# Altium schematic sheet Sheet1.SchDoc
size A3; SheetNumber: 1; SheetTotal: 1
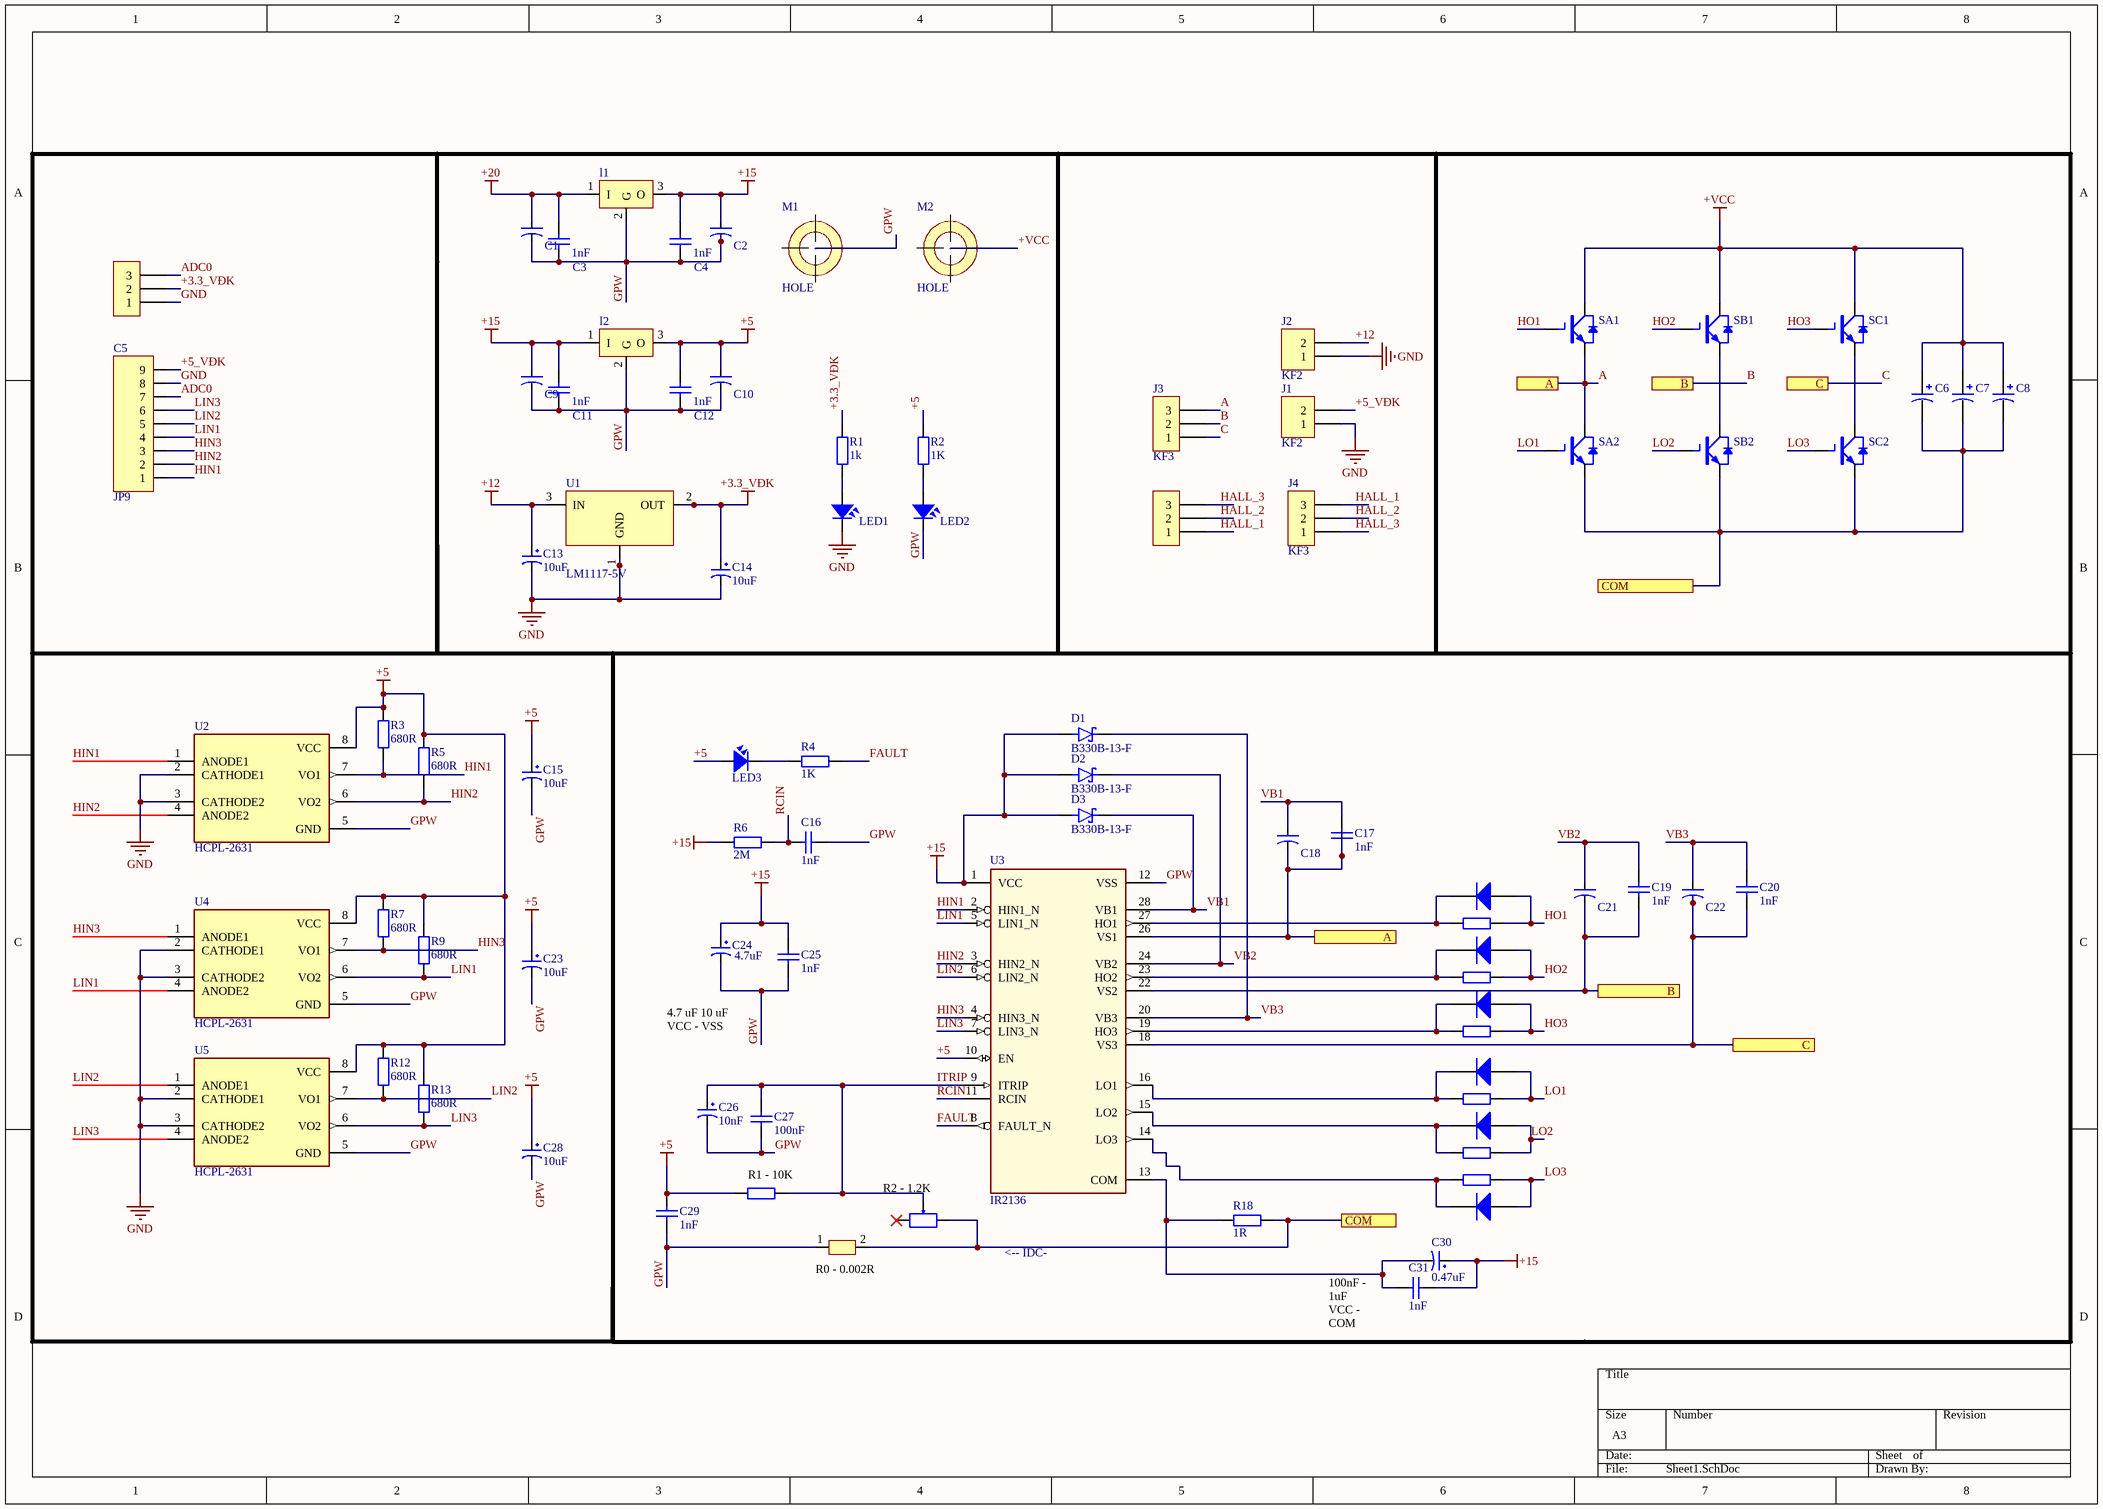
[diagram p0: Sheet1.SchDoc]

## Parts
*1  Component_1  [PCBComponent_1]  (value not drawn)
C1  CN-ALU-DIP  [CA-ALU-5]  (value not drawn)
C2  CN-ALU-DIP  [CA-ALU-5]  (value not drawn)
C3  1nF  [tu 1206]
C4  1nF  [tu 1206]
C5  JP9  [JP9-C1T]
C6  150uF - 450V  [CAP_ALUM_D160_S75_H250]  (value not drawn)
C7  150uF - 450V  [CAP_ALUM_D160_S75_H250]  (value not drawn)
C8  150uF - 450V  [CAP_ALUM_D160_S75_H250]  (value not drawn)
C9  CN-ALU-DIP  [CA-ALU-5]  (value not drawn)
C10  CN-ALU-DIP  [CA-ALU-5]  (value not drawn)
C11  1nF  [tu 1206]
C12  1nF  [tu 1206]
C13  10uF  [tu tantalum smd3216]
C14  10uF  [tu tantalum smd3216]
C15  10uF  [tu tantalum smd3216]
C16  1nF  [tu 1206]
C17  1nF  [tu 1206]
C18  CN-ALU-DIP  [CA-ALU-5]  (value not drawn)
C19  1nF  [tu 1206]
C20  1nF  [tu 1206]
C21  CN-ALU-DIP  [CA-ALU-5]  (value not drawn)
C22  CN-ALU-DIP  [CA-ALU-5]  (value not drawn)
C23  10uF  [tu tantalum smd3216]
C24  4.7uF  [tu tantalum smd3216]
C25  1nF  [tu 1206]
C26  10nF  [tu tantalum smd3216]
C27  100nF  [tu 1206]
C28  10uF  [tu tantalum smd3216]
C29  1nF  [tu 1206]
C30  0.47uF  [tu tantalum smd3216]
C31  1nF  [tu 1206]
D1  B330B-13-F  [DIOM5336X240N]
D2  B330B-13-F  [DIOM5336X240N]
D3  B330B-13-F  [DIOM5336X240N]
D4  SS14  [DIODE SMA]  (value not drawn)
D5  SS14  [DIODE SMA]  (value not drawn)
D6  SS14  [DIODE SMA]  (value not drawn)
D7  SS14  [DIODE SMA]  (value not drawn)
D8  SS14  [DIODE SMA]  (value not drawn)
D9  SS14  [DIODE SMA]  (value not drawn)
H1  Header 3P 2.54 Duc Thang  [XH2.54M-3]  (value not drawn)
H2  Header 3P 2.54 Duc Thang  [XH2.54M-3]  (value not drawn)
J1  KF2  [KF2-3.5]
J2  KF2  [KF2-3.5]
J3  KF3  [KF3-8.5]
J4  KF3  [KF3-3.5]
l1  LM78xx  [TO220-123]  (value not drawn)
l2  LM78xx  [TO220-123]  (value not drawn)
LED1  LED  [LED-1206-Blue]  (value not drawn)
LED2  LED  [LED-1206-Blue]  (value not drawn)
LED3  LED  [LED-1206-Blue]  (value not drawn)
M1  HOLE  [HOLE_3MM_5MM]  (no BOM)
M2  HOLE  [HOLE_3MM_5MM]  (no BOM)
R1  1k  [tro smd 1206]
R2  1K  [tro smd 1206]
R3  680R  [tro smd 1206]
R4  1K  [tro smd 1206]
R5  680R  [tro smd 1206]
R6  2M  [tro smd 1206]
R7  680R  [tro smd 1206]
R8  680R  [tro smd 1206]  (value not drawn)
R9  680R  [tro smd 1206]
R10  680R  [tro smd 1206]  (value not drawn)
R11  680R  [tro smd 1206]  (value not drawn)
R12  680R  [tro smd 1206]
R13  680R  [tro smd 1206]
R14  680R  [tro smd 1206]  (value not drawn)
R15  680R  [tro smd 1206]  (value not drawn)
R16  680R  [tro smd 1206]  (value not drawn)
R17  5.1K  [tro smd 1206]  (value not drawn)
R18  1R  [tro smd 1206]
R19  6K  [Bien Tro Vi Chinh Dung]  (value not drawn)
SA1  FGA25N120ANTD  [TO545P500X1560X1990-3P]  (value not drawn)
SA2  FGA25N120ANTD  [TO545P500X1560X1990-3P]  (value not drawn)
SB1  FGA25N120ANTD  [TO545P500X1560X1990-3P]  (value not drawn)
SB2  FGA25N120ANTD  [TO545P500X1560X1990-3P]  (value not drawn)
SC1  FGA25N120ANTD  [TO545P500X1560X1990-3P]  (value not drawn)
SC2  FGA25N120ANTD  [TO545P500X1560X1990-3P]  (value not drawn)
U1  LM1117-5V  [SOT223]
U2  HCPL-2631  [DIP762W65P254L965H470Q8]
U3  IR2136  [DIP1524W46P254L3740H635Q28B]
U4  HCPL-2631  [DIP762W65P254L965H470Q8]
U5  HCPL-2631  [DIP762W65P254L965H470Q8]

## Ports
A, B, C, COM

## Nets
+3.3_VĐK: C14.1 H1.2 R1.2 U1.2(OUT)
+5: C10.1 C12.1 C15.1 C23.1 C28.1 C29.1 l2.3(O) LED3.1 R2.2 R3.2 R5.2 R7.2 R9.2 R12.2 R13.2 R17.2 U2.8(VCC) U3.10(EN) U4.8(VCC) U5.8(VCC)
+12: C13.1 J2.2 U1.3(IN)
+15: C2.1 C4.1 C9.1 C11.1 C24.1 C25.1 C30.1 C31.1 D1.A D2.A D3.A l1.3(O) l2.1(I) R6.2 U3.1(VCC)
+20: C1.1 C3.1 l1.1(I)
+VCC: C6.1 C7.1 C8.1 SA1.2(C) SB1.2(C) SC1.2(C)
GND: C5.8 C13.2 C14.2 H1.1 J1.1 J2.1 LED1.2 U1.1(GND) U2.2(CATHODE1) U2.3(CATHODE2) U4.2(CATHODE1) U4.3(CATHODE2) U5.2(CATHODE1) U5.3(CATHODE2)
+5_VĐK: C5.9 J1.2
A: C17.2 C18.2 J3.3 SA1.3(E) SA2.2(C) U3.26(VS1) ; port A
ADC0: C5.7 H1.3
B: C19.2 C21.2 J3.2 U3.22(VS2) ; port B
C: C20.2 C22.2 J3.1 U3.18(VS3) ; port C
COM: *1.2 C6.2 C7.2 C8.2 R18.1 R19.3 SA2.3(E) SB2.3(E) SC2.3(E) ; port COM
FAULT: R4.2 U3.8(FAULT_N)
GPW: *1.1 C1.2 C2.2 C3.2 C4.2 C9.2 C10.2 C11.2 C12.2 C15.2 C16.2 C23.2 C24.2 C25.2 C26.2 C27.2 C28.2 C29.2 l1.2(G) l2.2(G) LED2.2 U2.5(GND) U3.12(VSS) U4.5(GND) U5.5(GND)
HALL_1: H2.1 J4.3
HALL_2: H2.2 J4.2
HALL_3: H2.3 J4.1
HIN1: C5.1 R3.1 U2.1(ANODE1) U2.7(VO1) U3.2(HIN1_N)
HIN2: C5.2 R5.1 U2.4(ANODE2) U2.6(VO2) U3.3(HIN2_N)
HIN3: C5.3 R7.1 U3.4(HIN3_N) U4.1(ANODE1) U4.7(VO1)
HO1: D4.1(A) R8.1 SA1.1(G)
HO2: D5.1(A) R10.1 SB1.1(G)
HO3: D6.1(A) R11.1 SC1.1(G)
ITRIP: C26.1 C27.1 R17.1 R19.2 U3.9(ITRIP)
LIN1: C5.4 R9.1 U3.5(LIN1_N) U4.4(ANODE2) U4.6(VO2)
LIN2: C5.5 R12.1 U3.6(LIN2_N) U5.1(ANODE1) U5.7(VO1)
LIN3: C5.6 R13.1 U3.7(LIN3_N) U5.4(ANODE2) U5.6(VO2)
LO1: D7.1(A) R14.1 SA2.1(G)
LO2: D8.1(A) R15.1 SB2.1(G)
LO3: D9.1(A) R16.1 SC2.1(G)
RCIN: C16.1 R6.1 U3.11(RCIN)
VB1: C17.1 C18.1 D3.C(K) U3.28(VB1)
VB2: C19.1 C21.1 D2.C(K) U3.24(VB2)
VB3: C20.1 C22.1 D1.C(K) U3.20(VB3)
NetC30_2: C30.2 C31.2 R18.2 U3.13(COM)
NetD4_2: D4.2(K) R8.2 U3.27(HO1)
NetD5_2: D5.2(K) R10.2 U3.23(HO2)
NetD6_2: D6.2(K) R11.2 U3.19(HO3)
NetD7_2: D7.2(K) R14.2 U3.16(LO1)
NetD8_2: D8.2(K) R15.2 U3.15(LO2)
NetD9_2: D9.2(K) R16.2 U3.14(LO3)
NetLED1_1: LED1.1 R1.1
NetLED2_1: LED2.1 R2.1
NetLED3_2: LED3.2 R4.1
NetSB1_3: SB1.3(E) SB2.2(C)
NetSC1_3: SC1.3(E) SC2.2(C)

Not connected (* = marked no-connect by the designer): R19 1*

## Notes on the sheet
- 4.7 uF 10 uF
  VCC - VSS
- (near R17) R1 - 10K
- (near R19) R2 - 1.2K
- <-- IDC-
- (near *1) R0 - 0.002R
- (near C31) 100nF - 1uF VCC - COM

## Library data of the parts
C1 C2 C9 C10 C18 C21 C22 = CN-ALU-DIP: Capacitor (Semiconductor SIM Model); Value: 104; LatestRevisionDate: 17-Jul-2002; LatestRevisionNote: Re-released for DXP Platform.; PackageReference: C1206; Publisher: Altium Limited
C3 C4 C11 C12 C16 C17 C19 C20 C25 C27 C29 C31 = Tu 1206 470pF 50V 10%: Dán; Don_Vi: Con; So_Chan: 2; Ten_Linh_Kien: Tụ 1206 470P 10% 50V; Ma_Hang: MH004548; Chung_Loai: Dán; Kieu_Chan: *
C5 = JP9: WR-PHD 2.54 mm Angled Socket Header; Manufacturer: W¨¹rth Elektronik eiSos GmbH; partNo: 613009143121; ComponentLink1 Description: Manufacturer; ComponentLink2 Description: Datasheet; NoPins: 09; Created Date: 29 March 2013; ComponentLink1URL: http://www.we-online.com; ComponentLink2URL: http://katalog.we-online.de/em/datasheet/6130xx143121.pdf; Created by: Karrer Zheng
C6-C8 = CLA4514: CAP ALUM 1000uF 20% 63V RADIAL; Value: 1000uF/63V; Solder: WAVE; MPN: CLA4514; Category: CAPACITOR; MFR_URL: http://linhkienchatluong.vn/tu-hoa-chat-luong-cao/tu-hoa-63v-47uf-nipponlelon-8x11mm_sp977_ct6500.aspx; PinCount: 2
C13-C15 C23 C24 C26 C28 C30 = Tu tantalum 10uF 16V SMD3216: Dán; Don_Vi: Con; So_Chan: 2; Ten_Linh_Kien: Tụ tantalum 106C-10uF 16V SMD3216; Ma_Hang: MH001954; Chung_Loai: Dán; Kieu_Chan: *
D1-D3 = B330B-13-F: Diode Schottky 30 V 3A Surface Mount SMB; MF: Diodes Inc.; Value: *; Check_prices: https://www.snapeda.com/parts/B330B-13-F/Diodes+Inc./view-part/?ref=eda; Availability: In Stock; Package: DO-214 Diodes Inc.; SnapEDA_Link: https://www.snapeda.com/parts/B330B-13-F/Diodes+Inc./view-part/?ref=snap; Price: None; Purchase-URL: https://pricing.snapeda.com/search/part/B330B-13-F/?ref=eda; MP: B330B-13-F
D4-D9 = Diode SS14 ( 1N5819): Dán; Ma_Hang: MH002211; Don_Vi: Con; Ten_Linh_Kien: Diode SS14 DO214 Schottky 1A 40V ( 1N5819 DO214); Chung_Loai: Dán; Ghi_Chu: *; Kieu_Chan: *
H1 H2 = Header 3P 2.54 Duc Thang: Cắm; Ten_Linh_Kien: Header 3P XH2.54-3P Đực Thẳng; Don_Vi: Con; Ma_Hang: MH001292; Chung_Loai: Cắm
J1 J2 = KF2: Manufacturer: Würth Elektronik eiSos GmbH; partNo: 691103110002; ComponentLink1 Description: Manufacturer; ComponentLink2 Description: Datasheet; NoPins: 2; Created Date: 29 October 2013; ComponentLink1URL: http://www.we-online.com; ComponentLink2URL: http://katalog.we-online.de/em/datasheet/6911031100xx.pdf; Created by: Karrer Zheng
J3 J4 = KF3: Manufacturer: Würth Elektronik eiSos GmbH; partNo: 691103110003; ComponentLink1 Description: Manufacturer; ComponentLink2 Description: Datasheet; NoPins: 3; Created Date: 29 October 2013; ComponentLink1URL: http://www.we-online.com; ComponentLink2URL: http://katalog.we-online.de/em/datasheet/6911031100xx.pdf; Created by: Karrer Zheng
l1 l2 = LM78xx: Positive Voltage Regulator; Note: Tab is connected to pin 3 (GND).; Published: 24-Aug-2001; LatestRevisionDate: 17-Jul-2002; LatestRevisionNote: Re-released for DXP Platform.; DatasheetVersion: Apr-1994; PackageVersion: Jul-1998; PackageReference: ISOWATT220AB; Publisher: Altium Limited; PackageDescription: TO, Thru-Hole, Vertical, Heatsink Mounted; 3 In-Line Leads; Pitch 2.54 mm; Pin sequence 1, 3, 2; ComponentLink1Description: Manufacturer Link; ComponentLink1URL: http://www.st.com/; ComponentLink2Description: Datasheet; ComponentLink2URL: http://www.st.com/stonline/products/literature/ds/2146/l78m05c.pdf
LED1-LED3 = LED SMD: Value: LED 3 - 5 ly 2 Colour
M1 M2 = HOLE_2_4/2_5/3_5/3_6: HOLE 2_4/2_5/3_5/3_6; MPN: None; Solder: Not Fill; CompanyID: VT-; ClassName: MECH_HOLE; Value: HOLE
R1-R18 = Tro 1206 5% 680R: Dán; Don_Vi: Con; So_Chan: 2; Ten_Linh_Kien: Trở 1206 5% 680R; Ma_Hang: MH005928; Chung_Loai: Dán; Kieu_Chan: *
R19 = Bien Tro Tinh Chinh 100R Dung: Cắm; Don_Vi: Con; Ten_Linh_Kien: Biến Trở VR 101-100R 3296W; Ma_Hang: MH003235; Kieu_Chan: *; Chung_Loai: Cắm
SA1 SA2 SB1 SB2 SC1 SC2 = FGA25N120ANTD: IGBT NPT and Trench 1200V 50A 312W Through Hole TO-3P; MF: ON Semiconductor; Value: *; Digi-Key_Purchase_URL: https://www.digikey.in/product-detail/en/on-semiconductor/FGA25N120ANTDTU/FGA25N120ANTDTU-ND/820640?utm_source=snapeda&utm_medium=aggregator&utm_campaign=symbol; MP: FGA25N120ANTD; Package: TO-3 Fairchild Semiconductor; SnapEDA_Link: https://www.snapeda.com/parts/FGA25N120ANTD/ON%20Semiconductor/view-part/202622/?ref=snap; Digi-Key_Part_Number: FGA25N120ANTDTU-ND
U1 = LM1117: 800mA Low-Dropout Linear Regulator; Creator: Nguyen Ba Bien; Website: http://group3i.net
U2 U4 U5 = HCPL-2631: Logic Output Optoisolator 10MBd Open Collector, Schottky Clamped 3750Vrms 2 Channel 10kV/Âµs CMTI 8-DIP Gull Wing; MF: Broadcom Limited; Price: None; Value: *; Package: DIP-8 Broadcom; SnapEDA_Link: https://www.snapeda.com/parts/HCPL-2631/Broadcom%20Limited/view-part/1749269/?ref=snap; Availability: Unavailable; MP: HCPL-2631
U3 = IR2136: High Voltage Gate Driver IC; Manufacturer: Infineon Technologies; Manufacturer Order Number: IR2136; PackageReference: PDIP28